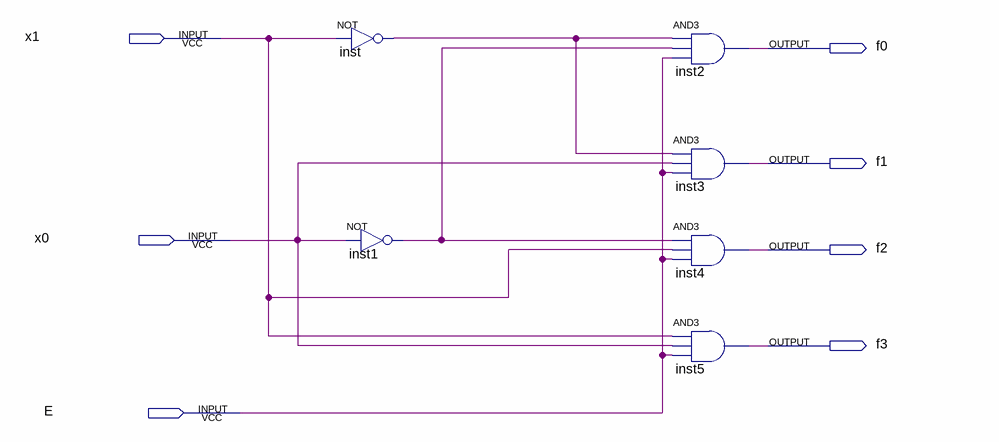
[diagram p0: schematic sheet]
// Quartus schematic dmx.bdf as structural Verilog: 6 symbols, 7 pins
module dmx (
  input  x1,
  input  x0,
  input  E,
  output f0,
  output f1,
  output f2,
  output f3
);

  wire inst1_out, inst_out;

  not inst (inst_out, x1);
  not inst1 (inst1_out, x0);
  and inst2 (f0, inst_out, inst1_out, E);
  and inst3 (f1, inst_out, x0, E);
  and inst4 (f2, inst1_out, x1, E);
  and inst5 (f3, x1, x0, E);
endmodule
